# EasyEDA Pro project 微型麦轮车底盘V7_2024-09-14.epro

# Schematic ESP32微型麦轮车底盘V3_驭风
Board Name: ESP32微型麦轮车底盘V3_驭风; Create Date: 2024-09-10; Page Name: Sheet_1; Schematic Name: ESP32微型麦轮车底盘V3_驭风; Update Date: 2024-09-13
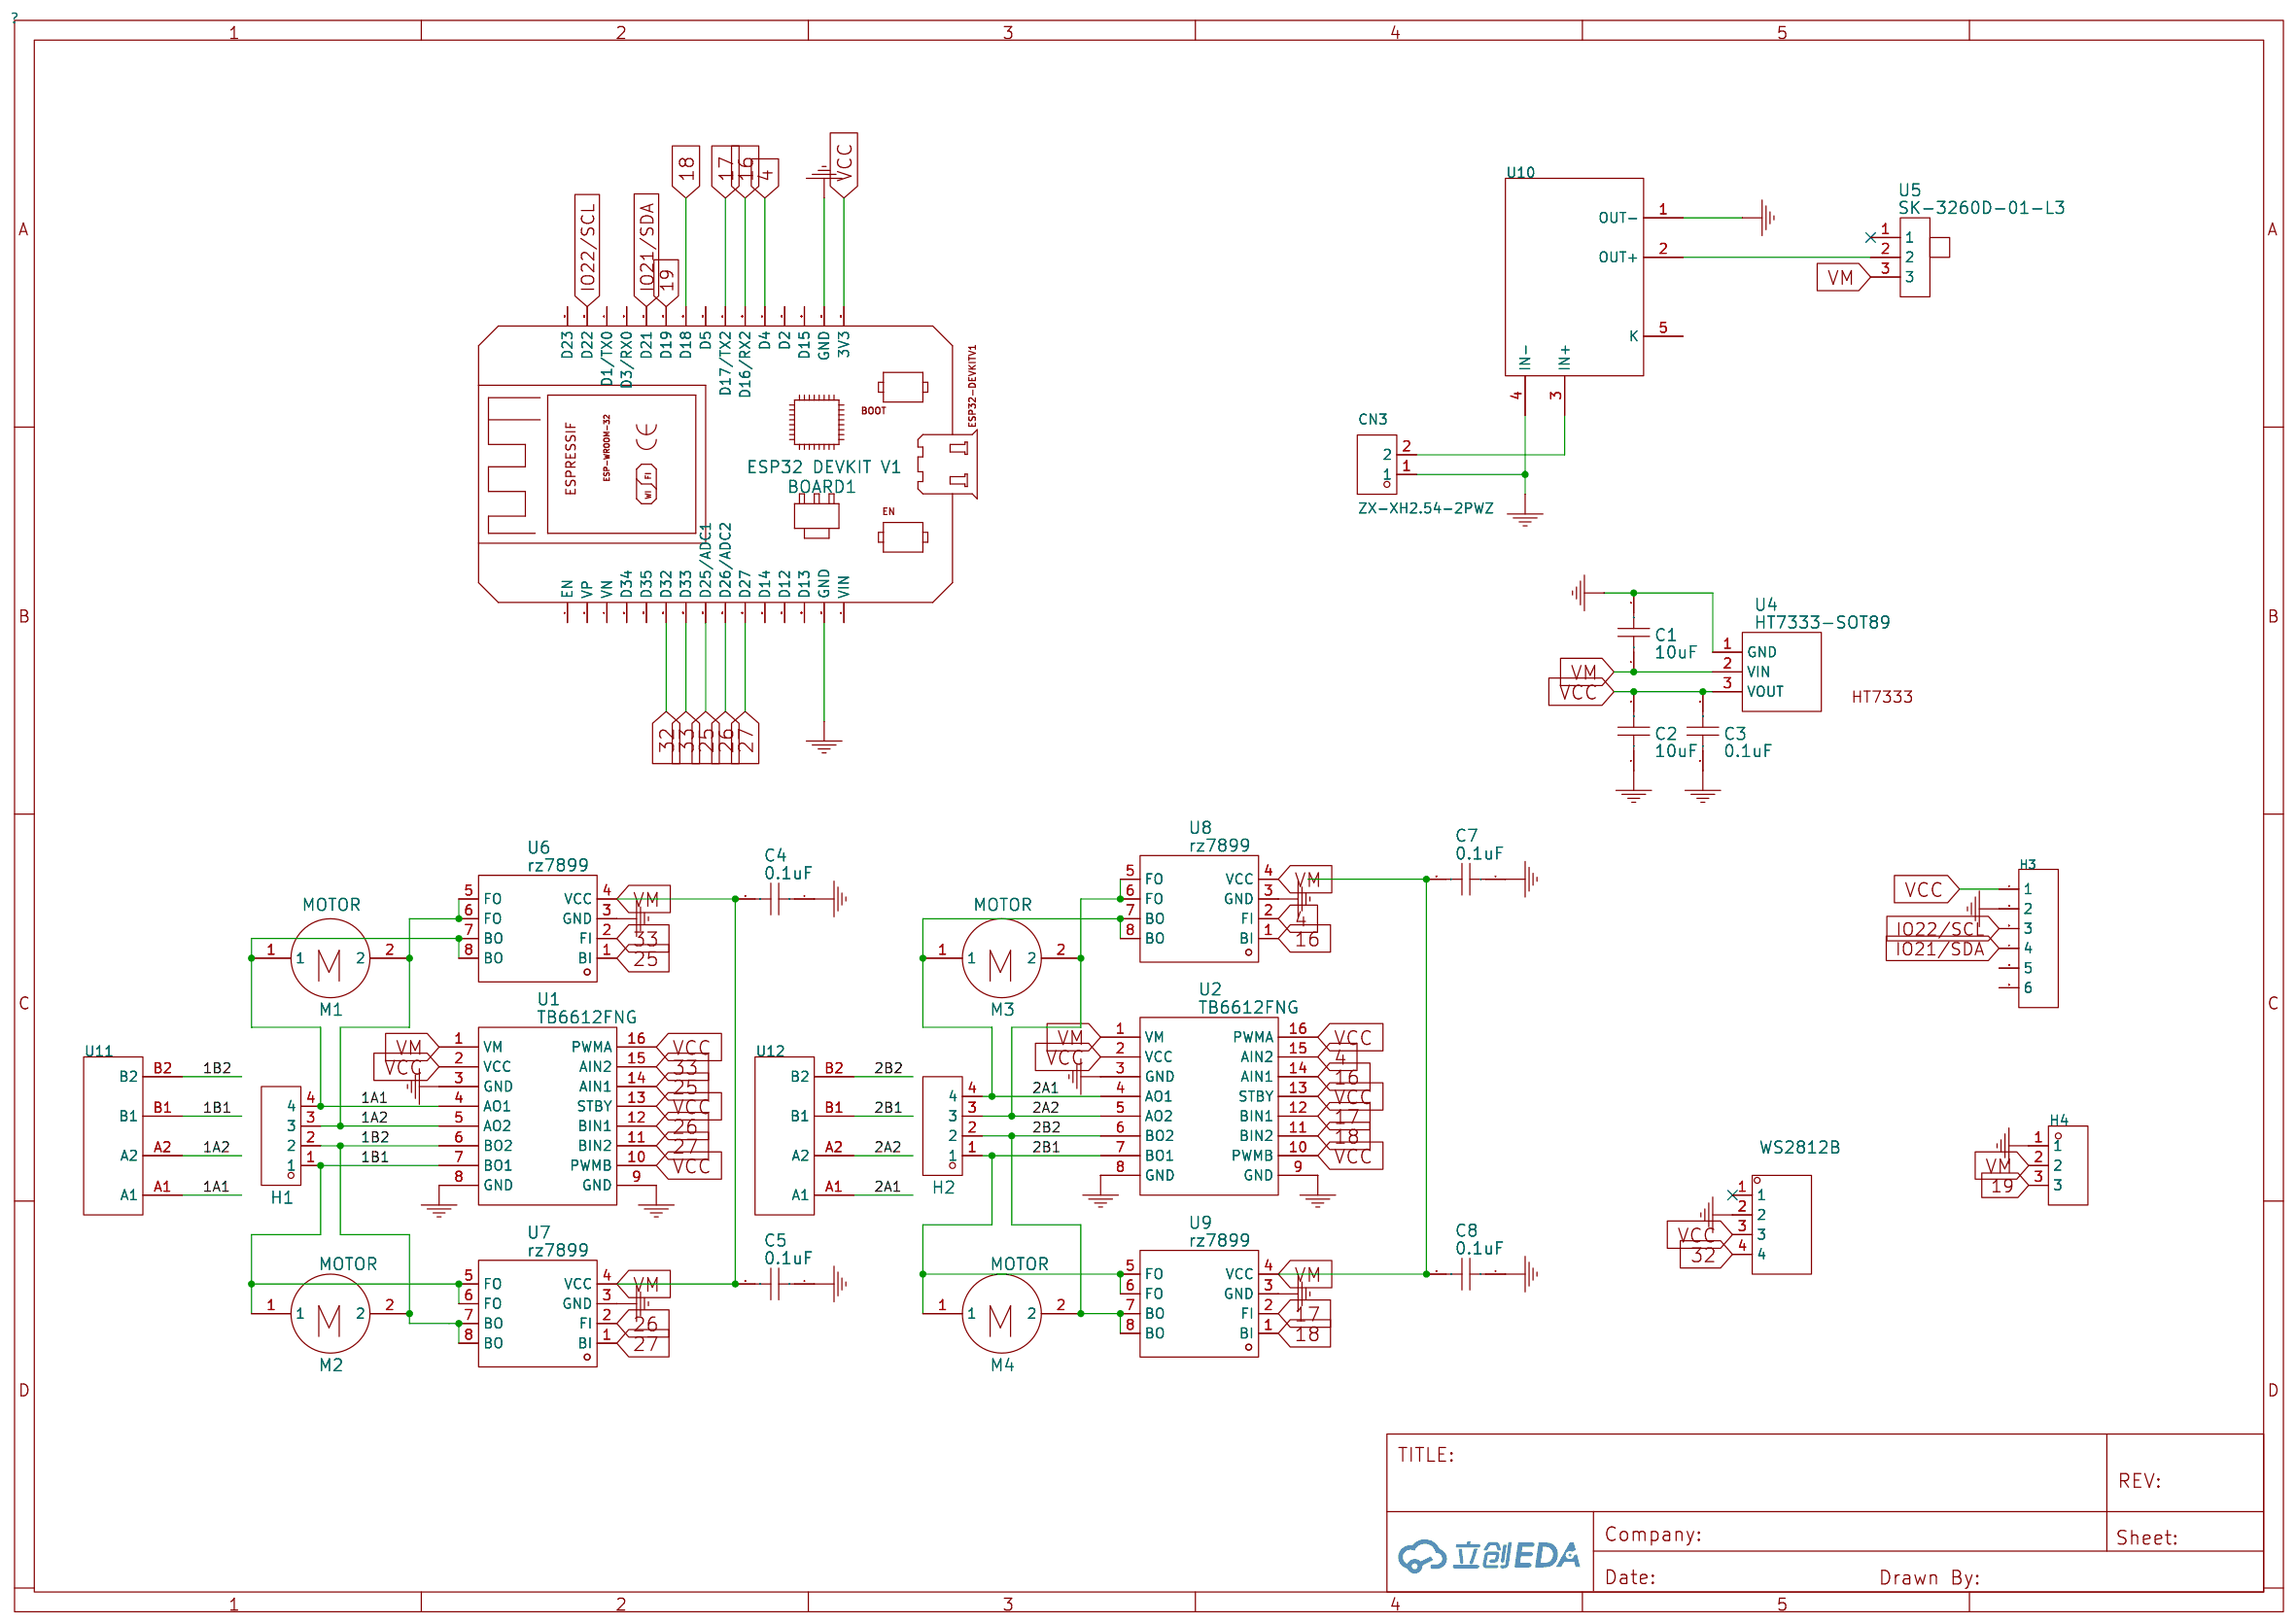
[diagram p0: schematic sheet]

## Parts
BOARD1  ESP32 DEVKIT V1  [ESP32-DEVKITV1]
C1  10uF  [C0805]
C2  10uF  [C0805]
C3  0.1uF  [C0805]
C4  0.1uF  [C0805]
C5  0.1uF  [C0805]
C7  0.1uF  [C0805]
C8  0.1uF  [C0805]
CN3  ZX-XH2.54-2PWZ  [CONN-TH_2P-P2.50_ZX-XH2.54-2PWZ]
H1  GP25-2521WV-4P  [HDR-TH_4P-P2.54-V-F]
H2  GP25-2521WV-4P  [HDR-TH_4P-P2.54-V-F]
H3  -  [HDR-TH_6P-P2.54-V-M-1]
H4  -  [HDR-TH_3P-P2.54-V-M]
M1  MOTOR  [MOTOR]
M2  MOTOR  [MOTOR]
M3  MOTOR  [MOTOR]
M4  MOTOR  [MOTOR]
U1  TB6612FNG  [TB6612FNG]
U2  TB6612FNG  [TB6612FNG]
U4  HT7333-SOT89  [HT7333_SOT-89]
U5  SK-3260D-01-L3  [SW-TH_SK-3260D-01-LX]
U6  rz7899  [SOP-8_L4.9-W3.9-P1.27-LS6.0-BL]
U7  rz7899  [SOP-8_L4.9-W3.9-P1.27-LS6.0-BL]
U8  rz7899  [SOP-8_L4.9-W3.9-P1.27-LS6.0-BL]
U9  rz7899  [SOP-8_L4.9-W3.9-P1.27-LS6.0-BL]
U10  -  [5V模块]
U11  -  [M]
U12  -  [M]
WS2812B  MTP125-1104S1  [HDR-TH_4P-P2.54-V]

## Library data of the parts
BOARD1 = ESP32 DEVKIT V1
C1-C5 C7 C8 = 0603F225M250NT: Supplier: LCSC; Supplier Part: C71001; Manufacturer: Guangdong Fenghua Advanced Tech
CN3 = ZX-XH2.54-2PWZ: 插针结构:1x2P;间距:2.54mm;安装方式:弯插;参考系列:XH;总PIN数:2P;排数:1;每排PIN数:2;行距:-;额定电流:3A;触头材质:黄铜;触头镀层:锡;工作温度范围:-25℃~+85℃;; Supplier Part: C7429641; Manufacturer: Megastar(兆星); Supplier Footprint: 弯插,P=2.54mm; JLCPCB Part Class: 扩展库; Datasheet: https://atta.szlcsc.com/upload/public/pdf/source/20230619/56AE8F2E01CDFEAA97FC89B5ED558AB5.pdf; Supplier: LCSC; Pins Structure: 1x2P; Pitch: 2.54mm; Mounting Style: 弯插; Reference Series: XH; Number of Pins: 2P; Number of Rows: 1; Number of PINs Per Row: 2; Current Rating (Max): 3A; Contact Material: 黄铜; Contact Plating: 锡; Operating Temperature Range: -25℃~+85℃
H1 H2 = GP25-2521WV-4P: Supplier: LCSC; Supplier Part: C2681745; Manufacturer: GEPU(歌普); JLCPCB Part Class: Extended Part
H3 = HDR-M_2.54_1x6P: Supplier Part: C37208; Supplier Footprint: 插件
H4 = HDR-M_2.54_1x3P: Supplier Part: C2937625; Supplier Footprint: 插件
M1-M4 = MOTOR
U1 U2 = TB6612FNG
U4 = HT7333-SOT89
U5 = SK-3260D-01-L3: Manufacturer: XKB Connectivity; Supplier Part: C692482; Supplier: Seeed
U6-U9 = rz7899: Supplier: LCSC; Manufacturer: RZ; Supplier Part: C92373; JLCPCB Part Class: Extended Part
U10 = 5V模块
U11 U12 = M
WS2812B = MTP125-1104S1: Supplier: LCSC; Supplier Part: C358686; Manufacturer: MINTRON; JLCPCB Part Class: Extended Part

## Nets
GND: BOARD1.GND BOARD1.GND@1(GND) C1.2 C2.1 C3.1 C4.1 C5.1 C7.1 C8.1 CN3.1 H3.2 H4.1 U1.3(GND) U1.8(GND) U1.9(GND) U2.3(GND) U2.8(GND) U2.9(GND) U4.1(GND) U6.3(GND) U7.3(GND) U8.3(GND) U9.3(GND) U10.1(OUT-) U10.4(IN-) WS2812B.2
VCC: BOARD1.3V3 C2.2 C3.2 H3.1 U1.2(VCC) U1.10(PWMB) U1.13(STBY) U1.16(PWMA) U2.2(VCC) U2.10(PWMB) U2.13(STBY) U2.16(PWMA) U4.3(VOUT) WS2812B.3
1A1: H1.4 M1.1 U1.4(AO1) U6.7(BO) U6.8(BO) U11.A1
1A2: H1.3 M1.2 U1.5(AO2) U6.5(FO) U6.6(FO) U11.A2
1B1: H1.1 M2.1 U1.7(BO1) U7.5(FO) U7.6(FO) U11.B1
1B2: H1.2 M2.2 U1.6(BO2) U7.7(BO) U7.8(BO) U11.B2
2A1: H2.4 M3.1 U2.4(AO1) U8.7(BO) U8.8(BO) U12.A1
2A2: H2.3 M3.2 U2.5(AO2) U8.5(FO) U8.6(FO) U12.A2
2B1: H2.1 M4.1 U2.7(BO1) U9.5(FO) U9.6(FO) U12.B1
2B2: H2.2 M4.2 U2.6(BO2) U9.7(BO) U9.8(BO) U12.B2
4: BOARD1.D4 U2.15(AIN2) U8.2(FI)
16: BOARD1.D16(D16/RX2) U2.14(AIN1) U8.1(BI)
17: BOARD1.D17(D17/TX2) U2.12(BIN1) U9.2(FI)
18: BOARD1.D18 U2.11(BIN2) U9.1(BI)
19: BOARD1.D19 H4.3
25: BOARD1.D25(D25/ADC1) U1.14(AIN1) U6.1(BI)
26: BOARD1.D26(D26/ADC2) U1.12(BIN1) U7.2(FI)
27: BOARD1.D27 U1.11(BIN2) U7.1(BI)
32: BOARD1.D32 WS2812B.4
33: BOARD1.D33 U1.15(AIN2) U6.2(FI)
IO21/SDA: BOARD1.D21 H3.4
IO22/SCL: BOARD1.D22 H3.3
VM: C1.1 C4.2 C5.2 C7.2 C8.2 H4.2 U1.1(VM) U2.1(VM) U4.2(VIN) U5.3 U6.4(VCC) U7.4(VCC) U8.4(VCC) U9.4(VCC)
$1N278: U5.2 U10.2(OUT+)
$1N1630: CN3.2 U10.3(IN+)

Not connected (* = marked no-connect by the designer): BOARD1 D1(D1/TX0) D2 D3(D3/RX0) D5 D12 D13 D14 D15 D23 D34 D35 EN VIN VN VP; H3 5 6; U5 1*; U10 5(K); WS2812B 1*

# Board ESP32_Mecanum_Car_PCB_V3
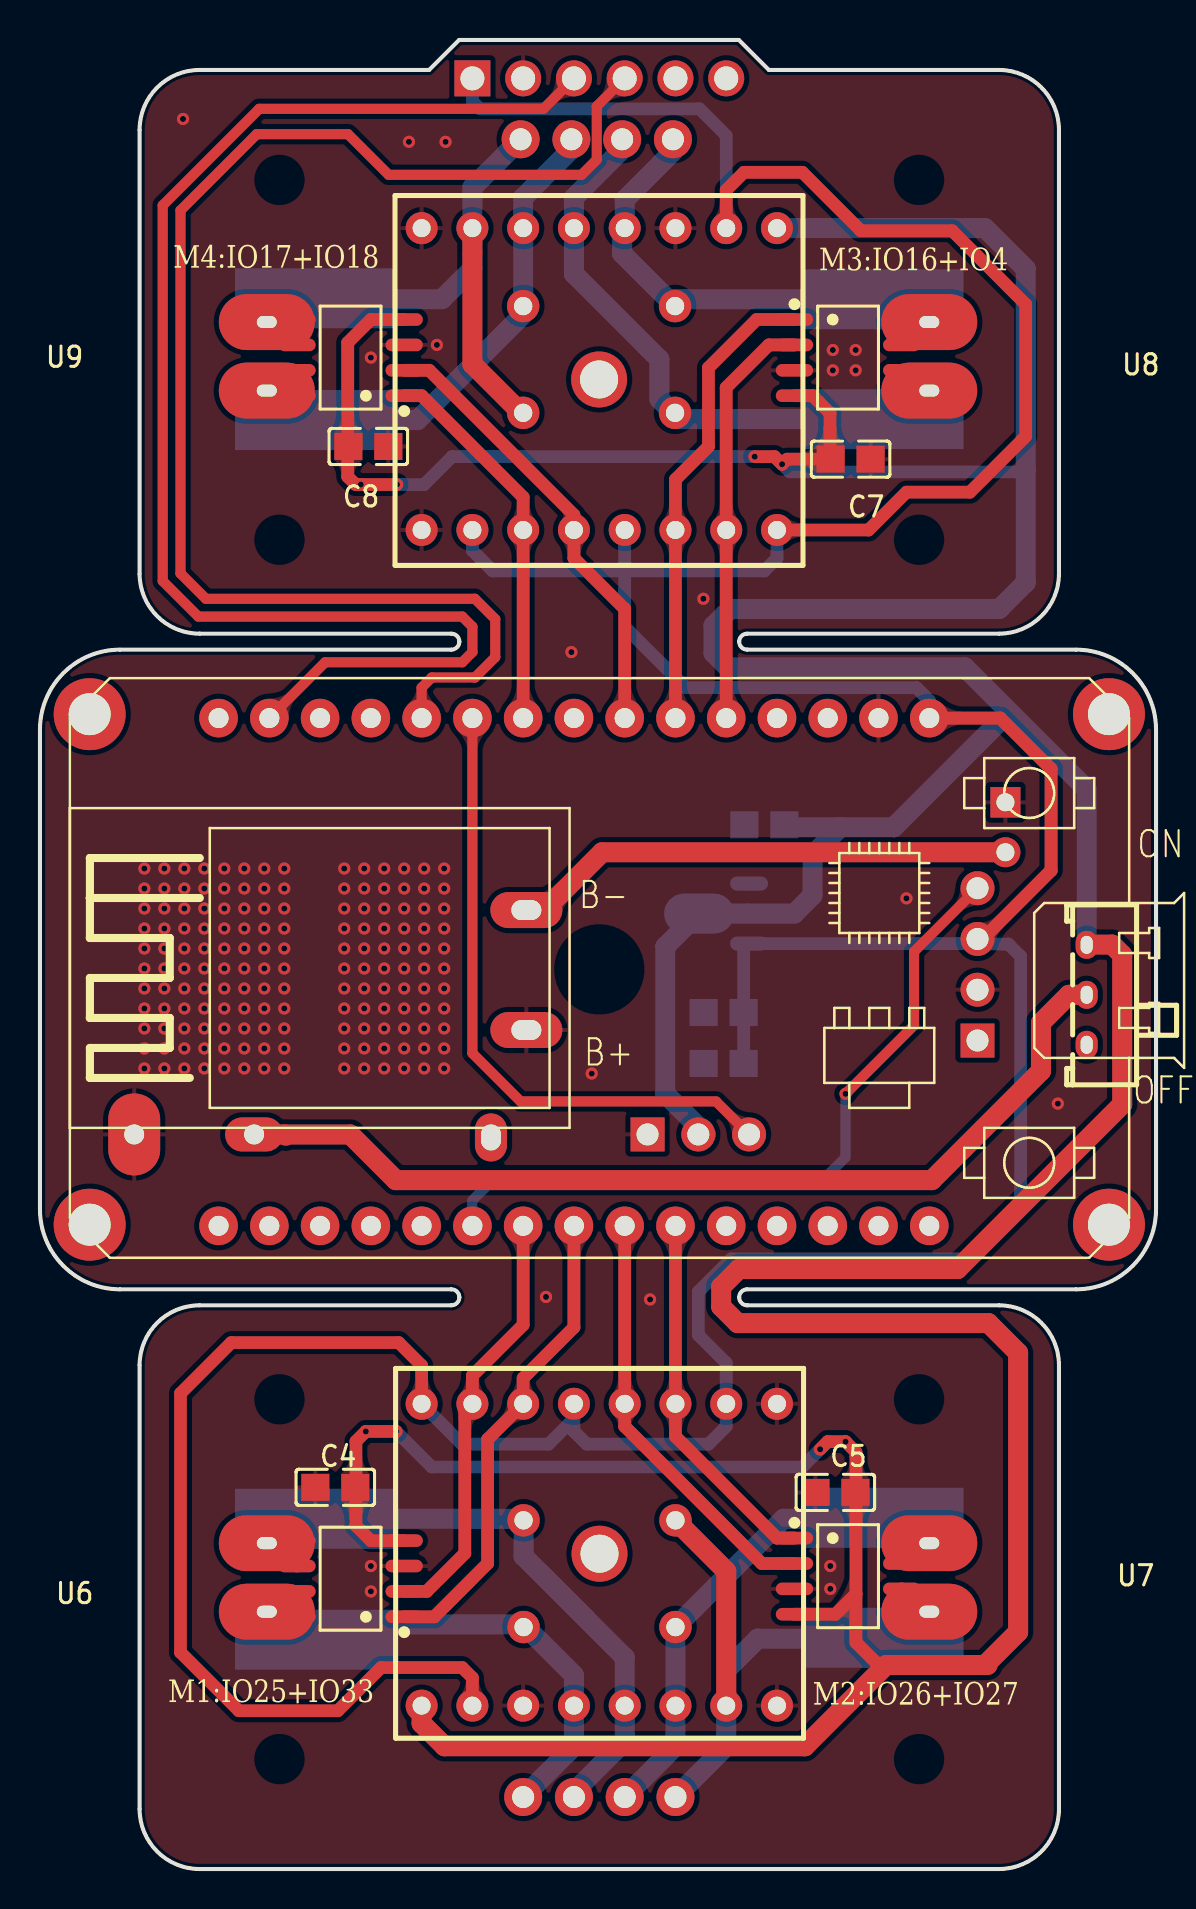
[diagram p1: board, top side]
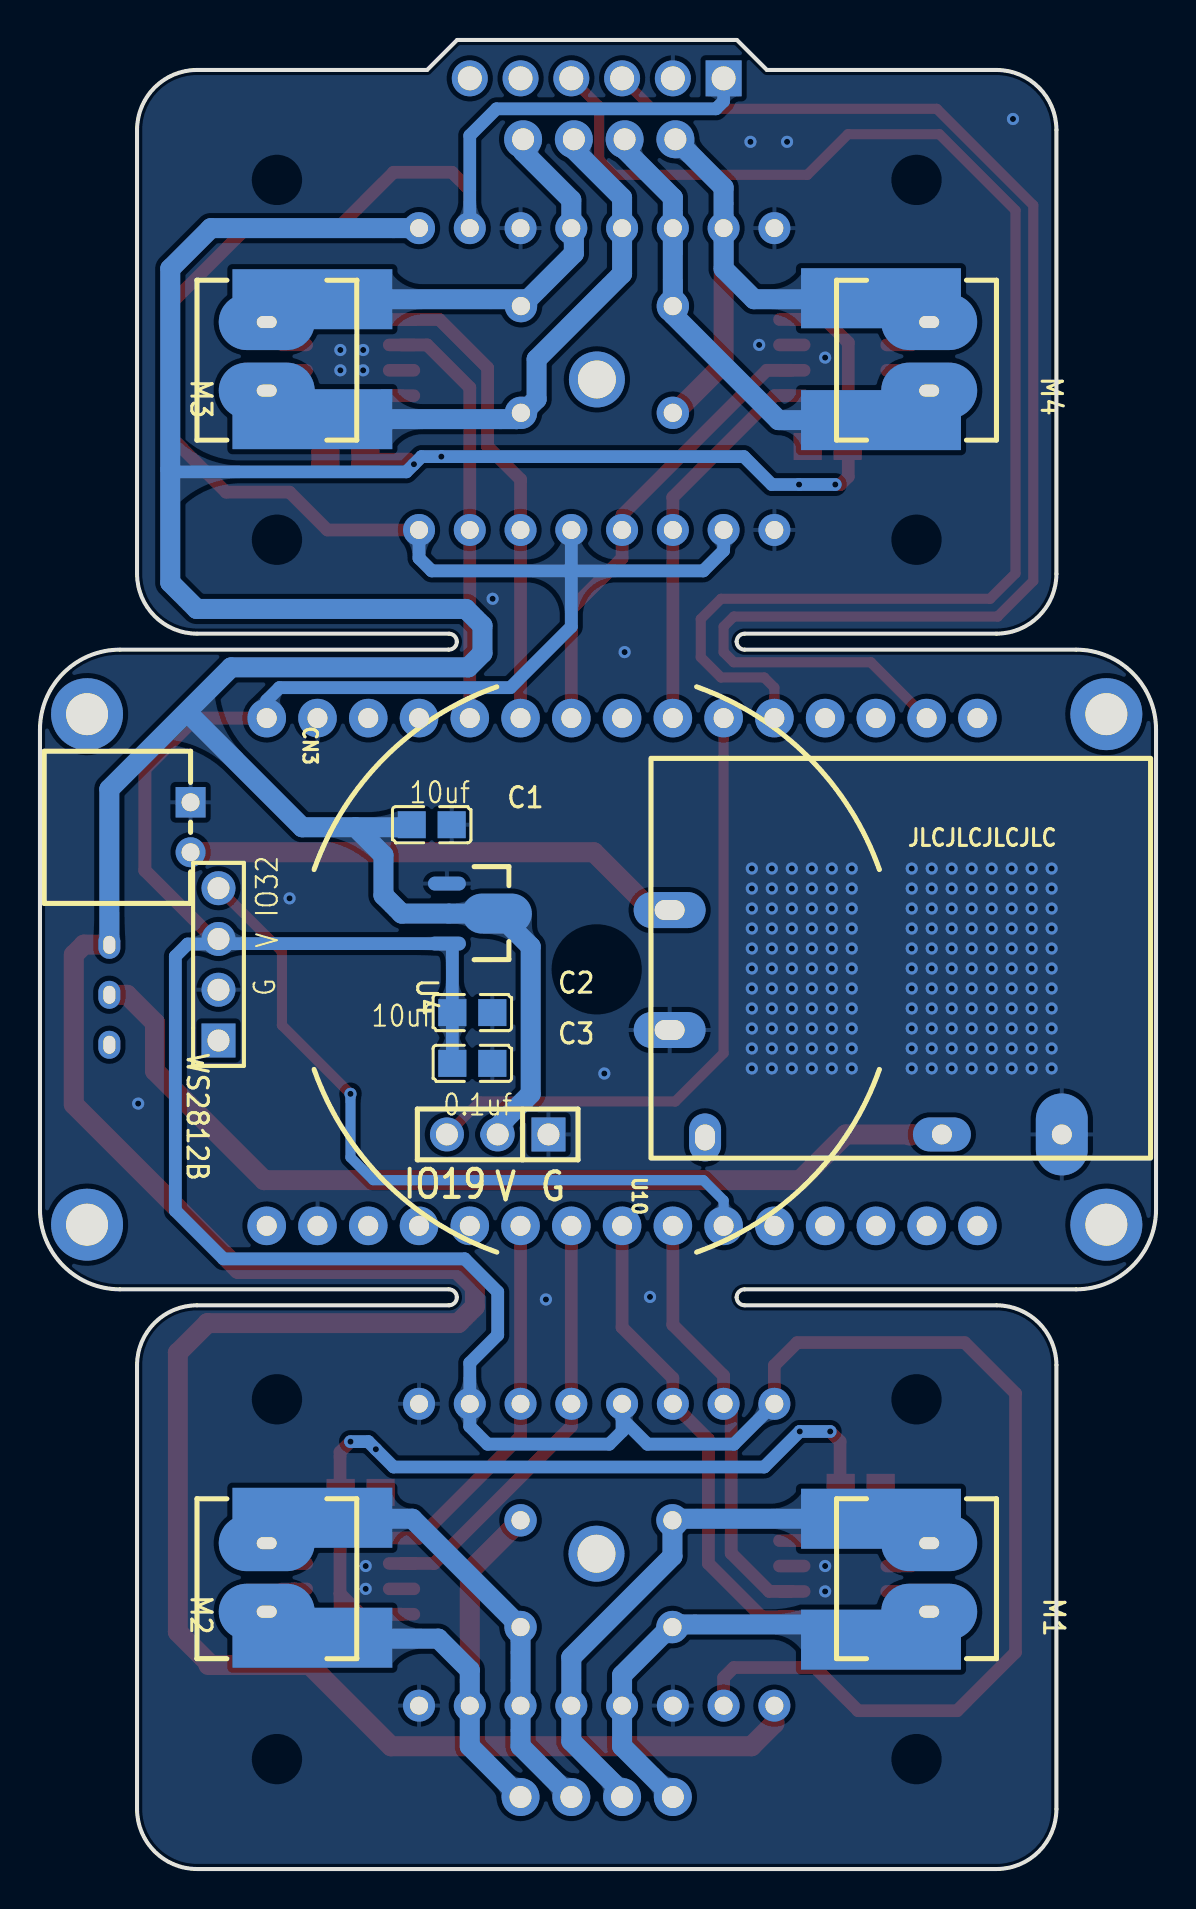
[diagram p2: board, bottom side, seen from below]

Outline 55.84 x 91.5 mm; copper layers: Top Layer, Bottom Layer. Coordinates in mm from the lower left corner of the outline.
Outline path: 0,57 0,33 arc(1.17,30.17) 4,29 20.58,29 arc(20.87,28.88) 20.98,28.6 arc(20.87,28.32) 20.58,28.2 7.98,28.2 arc(5.86,27.32) 4.98,25.2 4.98,3 arc(5.86,0.88) 7.98,0 47.98,0 arc(50.11,0.88) 50.98,3 50.98,25.2 arc(50.11,27.32) 47.98,28.2 35.38,28.2 arc(35.1,28.32) 34.98,28.6 arc(35.1,28.88) 35.38,29 51.84,29 arc(54.67,30.17) 55.84,33 55.84,57 arc(54.67,59.83) 51.84,61 35.38,61 arc(35.1,61.12) 34.98,61.4 arc(35.1,61.68) 35.38,61.8 47.98,61.8 arc(50.11,62.68) 50.98,64.8 50.98,87 arc(50.11,89.12) 47.98,90 36.47,90 34.97,91.5 20.97,91.5 19.47,90 7.98,90 arc(5.86,89.12) 4.98,87 4.98,64.8 arc(5.86,62.68) 7.98,61.8 20.58,61.8 arc(20.87,61.68) 20.98,61.4 arc(20.87,61.12) 20.58,61 4,61 arc(1.17,59.83) 0,57
Stack: Top Layer 0.035mm / Dielectric1 1.51mm FR4 er 4.5 / Bottom Layer 0.035mm

## Design rules (mm)
spacing Default (default): track to track 0.152, other pairs 0 to 0.152
track width Default (default): min 0.254, default 0.254, max 25.4
differential pair differentialPair (default): width min 0.127, default 0.254, max 2.54; gap min 0.152, default 0.152
via Default (default): diameter min 0.61, default 0.61, max 100.025; hole min 0.305, default 0.305, max 59.995
net GND uses gge16739

## Placement (name value [footprint] x y rotation side)
BOARD1  ESP32 DEVKIT V1  [ESP32-DEVKITV1]  44.5 57.58 180 top
C1  10uF  [C0805]  36.24 52.24 180 bottom
C2  10uF  [C0805]  34.21 42.84 0 bottom
C3  0.1uF  [C0805]  34.21 40.3 0 bottom
C4  0.1uF  [C0805]  14.78 19.09 0 top
C5  0.1uF  [C0805]  39.8 18.84 0 top
C7  0.1uF  [C0805]  40.56 70.53 180 top
C8  0.1uF  [C0805]  16.43 71.16 180 top
CN3  ZX-XH2.54-2PWZ  [CONN-TH_2P-P2.50_ZX-XH2.54-2PWZ]  48.31 52.11 270 bottom
H1  GP25-2521WV-4P  [HDR-TH_4P-P2.54-V-F]  27.99 3.6 180 top
H2  GP25-2521WV-4P  [HDR-TH_4P-P2.54-V-F]  27.86 86.53 0 top
H3  -  [HDR-TH_6P-P2.54-V-M-1]  27.99 89.58 0 top
H4  -  [HDR-TH_3P-P2.54-V-M]  32.94 36.75 0 bottom
M1  -  [MOTOR]  11.98 14.52 90 bottom
M2  -  [MOTOR]  43.99 14.52 90 bottom
M3  -  [MOTOR]  43.99 75.48 270 bottom
M4  -  [MOTOR]  11.98 75.48 270 bottom
NOREF  -  [Pad_e1394]  53.49 57.77 0 top
NOREF#2  -  [Pad_e944]  11.35 73.96 270 top
NOREF#3  -  [Pad_e943]  11.35 77.39 270 top
NOREF#4  -  [Pad_e97]  13.76 72.48 0 top
NOREF#5  -  [Pad_e941]  44.5 12.87 270 top
NOREF#6  -  [Pad_e98]  42.21 72.53 0 top
NOREF#7  -  [Pad_e1396]  53.49 32.23 0 top
NOREF#8  -  [Pad_e939]  11.35 16.3 270 top
NOREF#9  -  [Pad_e103]  42.21 17.57 0 top
NOREF#10  -  [Pad_e99]  42.21 78.53 0 top
NOREF#11  -  [Pad_e945]  44.5 77.39 270 top
NOREF#12  -  [Pad_e100]  13.76 17.52 0 top
NOREF#13  -  [Pad_e1395]  2.49 32.23 0 top
NOREF#14  -  [Pad_e940]  11.35 12.87 270 top
NOREF#15  -  [Pad_e101]  13.76 11.47 0 top
NOREF#16  -  [Pad_e1393]  2.49 57.77 0 top
NOREF#17  -  [Pad_e942]  44.5 16.3 270 top
NOREF#18  -  [Pad_e102]  42.21 11.57 0 top
NOREF#19  -  [Pad_e946]  44.5 73.96 270 top
NOREF#20  -  [Pad_e96]  13.76 78.58 0 top
U1  -  [TB6612FNG]  19.1 8.17 90 top
U2  -  [TB6612FNG]  36.88 82.09 270 top
U4  HT7333-SOT89  [HT7333_SOT-89]  32.94 47.67 270 bottom
U5  SK-3260D-01-L3  [SW-TH_SK-3260D-01-LX]  52.37 43.73 90 top
U6  rz7899  [SOP-8_L4.9-W3.9-P1.27-LS6.0-BL]  15.54 14.52 90 top
U7  rz7899  [SOP-8_L4.9-W3.9-P1.27-LS6.0-BL]  40.43 14.65 270 top
U8  rz7899  [SOP-8_L4.9-W3.9-P1.27-LS6.0-BL]  40.43 75.61 270 top
U9  rz7899  [SOP-8_L4.9-W3.9-P1.27-LS6.0-BL]  15.54 75.61 90 top
U10  -  [5V模块]  10.71 36.75 90 bottom
U11  -  [M]  31.8 17.44 180 top
U12  -  [M]  24.18 72.85 0 top
WS2812B  MTP125-1104S1  [HDR-TH_4P-P2.54-V]  46.91 45.26 90 bottom

## Footprints (pads in the part's own frame, mm; a bottom-side part is the same pattern mirrored in y, then rotated)
5V模块
  oval 4.1x2.6 hole 1: 1(0,-6)
  oval 1.7x2.9 hole 1: 2(0,0)
  oval 1.8x3.6 hole 1x1.5: 3(11.225,13.622) 4(5.225,13.622)
  oval 2.4x1.6 hole 1.3x1: 5(-0.15,11.85)
C0805
  rect 1.41x1.35 smd: 1(-1,0) 2(1,0)
CONN-TH_2P-P2.50_ZX-XH2.54-2PWZ
  rect 1.524x1.5 hole 0.9: 1(-1.25,0)
  round 1.5 hole 0.9: 2(1.25,0)
ESP32-DEVKITV1
  round 1.931 hole 1x1: 3V3(0,0) D1(30.48,0) D2(7.62,0) D3(27.94,0) D4(10.16,0) D5(17.78,0) D12(7.62,25.4) D13(5.08,25.4) D14(10.16,25.4) D15(5.08,0) D16(12.7,0) D17(15.24,0) D18(20.32,0) D19(22.86,0) D21(25.4,0) D22(33.02,0) D23(35.56,0) D25(17.78,25.4) D26(15.24,25.4) D27(12.7,25.4) D32(22.86,25.4) D33(20.32,25.4) D34(27.94,25.4) D35(25.4,25.4) EN(35.56,25.4) GND(2.54,25.4) GND@1(2.54,0) VIN(0,25.4) VN(30.48,25.4) VP(33.02,25.4)
HDR-TH_3P-P2.54-V-M
  rect 1.7x1.7 hole 1.1: 1(-2.54,0)
  round 1.7 hole 1.1: 2(0,0) 3(2.54,0)
HDR-TH_4P-P2.54-V
  rect 1.7x1.7 hole 1.1: 1(-3.81,0)
  round 1.7 hole 1.1: 2(-1.27,0) 3(1.27,0) 4(3.81,0)
HDR-TH_4P-P2.54-V-F
  round 1.9 hole 1.1x1: 1(-3.81,0) 2(-1.27,0) 3(1.27,0) 4(3.81,0)
HDR-TH_6P-P2.54-V-M-1
  rect 1.8x1.8 hole 1.2: 1(-6.35,0)
  round 1.8 hole 1.2: 2(-3.81,0) 3(-1.27,0) 4(1.27,0) 5(3.81,0) 6(6.35,0)
HT7333_SOT-89
  oval 0.7x1.9 smd: 1(-1.628,-2.54) 3(1.374,-2.54)
  oval 0.7x2.1 smd: 2(-0.127,-2.441)
  oval 2x3.5 smd: 2(-0.127,-0.041)
M
  round 2.8 hole 1.9: 0(3.8,1.67)
  round 1.62 hole 0.914: A1(7.6,5.34) A2(7.6,0) B1(0,0) B2(0,5.34)
MOTOR
  rect 2x4 smd: 1(-3,0) 2(3,0)
Pad_e96
  rect 8x3 smd far side: 2(0,0)
Pad_e97
  rect 8x3 smd far side: 1(0,0)
Pad_e98
  rect 8x3 smd far side: 1(0,0)
Pad_e99
  rect 8x3 smd far side: 1(0,0)
Pad_e100
  rect 8x3 smd far side: 1(0,0)
Pad_e101
  rect 8x3 smd far side: 1(0,0)
Pad_e102
  rect 8x3 smd far side: 1(0,0)
Pad_e103
  rect 8x3 smd far side: 1(0,0)
Pad_e939
  oval 2.8x4.8 hole 0.6x1: 3(0,0)
Pad_e940
  oval 2.8x4.8 hole 0.6x1: 3(0,0)
Pad_e941
  oval 2.8x4.8 hole 0.6x1: 3(0,0)
Pad_e942
  oval 2.8x4.8 hole 0.6x1: 3(0,0)
Pad_e943
  oval 2.8x4.8 hole 0.6x1: 3(0,0)
Pad_e944
  oval 2.8x4.8 hole 0.6x1: 3(0,0)
Pad_e945
  oval 2.8x4.8 hole 0.6x1: 3(0,0)
Pad_e946
  oval 2.8x4.8 hole 0.6x1: 3(0,0)
Pad_e1393
  round 3.6 hole 2.1: 1(0,0)
Pad_e1394
  round 3.6 hole 2.1: 2(0,0)
Pad_e1395
  round 3.6 hole 2.1: 3(0,0)
Pad_e1396
  round 3.6 hole 2.1: 4(0,0)
SOP-8_L4.9-W3.9-P1.27-LS6.0-BL
  oval 0.63x1.865 smd: 1(-1.905,-2.683) 2(-0.635,-2.683) 3(0.635,-2.683) 4(1.905,-2.683) 5(1.905,2.683) 6(0.635,2.683) 7(-0.635,2.683) 8(-1.905,2.683)
SW-TH_SK-3260D-01-LX
  oval 1.4x1.1 hole 0.9x0.6: 1(-2.5,0) 2(0,0) 3(2.5,0)
TB6612FNG
  round 1.6 hole 0.9: 1(0,0) 2(0,-2.54) 3(0,-5.08) 4(0,-7.62) 5(0,-10.16) 6(0,-12.7) 7(0,-15.24) 8(0,-17.78) 9(15.1,-17.78) 10(15.1,-15.24) 11(15.1,-12.7) 12(15.1,-10.16) 13(15.1,-7.62) 14(15.1,-5.08) 15(15.1,-2.54) 16(15.1,0)

## Nets
GND: BOARD1.GND BOARD1.GND@1 C1.2 C2.1 C3.1 C4.1 C5.1 C7.1 C8.1 CN3.1 H3.2 H4.1 U1.3 U1.8 U1.9 U2.3 U2.8 U2.9 U4.1 U6.3 U7.3 U8.3 U9.3 U10.1 U10.4 WS2812B.2
VCC: BOARD1.3V3 C2.2 C3.2 H3.1 U1.2 U1.10 U1.13 U1.16 U2.2 U2.10 U2.13 U2.16 U4.3 WS2812B.3
1A1: H1.4 M1.1 NOREF#14.3 NOREF#15.1 U1.4 U6.7 U6.8 U11.A1
1A2: H1.3 M1.2 NOREF#8.3 NOREF#12.1 U1.5 U6.5 U6.6 U11.A2
1B1: H1.1 M2.1 NOREF#5.3 NOREF#18.1 U1.7 U7.5 U7.6 U11.B1
1B2: H1.2 M2.2 NOREF#9.1 NOREF#17.3 U1.6 U7.7 U7.8 U11.B2
2A1: H2.4 M3.1 NOREF#10.1 NOREF#11.3 U2.4 U8.7 U8.8 U12.A1
2A2: H2.3 M3.2 NOREF#6.1 NOREF#19.3 U2.5 U8.5 U8.6 U12.A2
2B1: H2.1 M4.1 NOREF#3.3 NOREF#20.2 U2.7 U9.5 U9.6 U12.B1
2B2: H2.2 M4.2 NOREF#2.3 NOREF#4.1 U2.6 U9.7 U9.8 U12.B2
4: BOARD1.D4 U2.15 U8.2
16: BOARD1.D16 U2.14 U8.1
17: BOARD1.D17 U2.12 U9.2
18: BOARD1.D18 U2.11 U9.1
19: BOARD1.D19 H4.3
25: BOARD1.D25 U1.14 U6.1
26: BOARD1.D26 U1.12 U7.2
27: BOARD1.D27 U1.11 U7.1
32: BOARD1.D32 WS2812B.4
33: BOARD1.D33 U1.15 U6.2
IO21/SDA: BOARD1.D21 H3.4
IO22/SCL: BOARD1.D22 H3.3
VM: C1.1 C4.2 C5.2 C7.2 C8.2 H4.2 U1.1 U2.1 U4.2 U5.3 U6.4 U7.4 U8.4 U9.4
$1N278: U5.2 U10.2
$1N1630: CN3.2 U10.3

Pads without a net: BOARD1 D1 D2 D3 D5 D12 D13 D14 D15 D23 D34 D35 EN VIN VN VP; H3 5 6; NOREF 2; NOREF#7 4; NOREF#13 3; NOREF#16 1; U5 1; U10 5; U11 0; U12 0; WS2812B 1

## Via types
v1: diameter 0.61, hole 0.305, Top Layer to Bottom Layer, 183 vias

## Routing (per net, layer and track width the routed paths; a pad name or vN(x,y) marks a point on that pad's centre or on a via; arc(x,y) is an arc through that point)
GND:
  vias: v1(5.22,50.05) v1(5.22,49.05) v1(5.22,48.05) v1(5.22,47.05) v1(5.22,46.05) v1(5.22,45.05) v1(5.22,44.05) v1(5.22,43.05) v1(5.22,42.05) v1(5.22,41.05) v1(5.22,40.05) v1(6.22,50.05) v1(6.22,49.05) v1(6.22,48.05) v1(6.22,47.05) v1(6.22,46.05) v1(6.22,45.05) v1(6.22,44.05) v1(6.22,43.05) v1(6.22,42.05) v1(6.22,41.05) v1(6.22,40.05) v1(7.16,87.55) v1(7.22,50.05) v1(7.22,49.05) v1(7.22,48.05) v1(7.22,47.05) v1(7.22,46.05) v1(7.22,45.05) v1(7.22,44.05) v1(7.22,43.05) v1(7.22,42.05) v1(7.22,41.05) v1(7.22,40.05) v1(8.22,50.05) v1(8.22,49.05) v1(8.22,48.05) v1(8.22,47.05) v1(8.22,46.05) v1(8.22,45.05) v1(8.22,44.05) v1(8.22,43.05) v1(8.22,42.05) v1(8.22,41.05) v1(8.22,40.05) v1(9.22,50.05) v1(9.22,49.05) v1(9.22,48.05) v1(9.22,47.05) v1(9.22,46.05) v1(9.22,45.05) v1(9.22,44.05) v1(9.22,43.05) v1(9.22,42.05) v1(9.22,41.05) v1(9.22,40.05) v1(10.22,50.05) v1(10.22,49.05) v1(10.22,48.05) v1(10.22,47.05) v1(10.22,46.05) v1(10.22,45.05) v1(10.22,44.05) v1(10.22,43.05) v1(10.22,42.05) v1(10.22,41.05) v1(10.22,40.05) v1(11.22,50.05) v1(11.22,49.05) v1(11.22,48.05) v1(11.22,47.05) v1(11.22,46.05) v1(11.22,45.05) v1(11.22,44.05) v1(11.22,43.05) v1(11.22,42.05) v1(11.22,41.05) v1(11.22,40.05) v1(12.22,50.05) v1(12.22,49.05) v1(12.22,48.05) v1(12.22,47.05) v1(12.22,46.05) v1(12.22,45.05) v1(12.22,44.05) v1(12.22,43.05) v1(12.22,42.05) v1(12.22,41.05) v1(12.22,40.05) v1(15.22,50.05) v1(15.22,49.05) v1(15.22,48.05) v1(15.22,47.05) v1(15.22,46.05) v1(15.22,45.05) v1(15.22,44.05) v1(15.22,43.05) v1(15.22,42.05) v1(15.22,41.05) v1(15.22,40.05) v1(16.22,50.05) v1(16.22,49.05) v1(16.22,48.05) v1(16.22,47.05) v1(16.22,46.05) v1(16.22,45.05) v1(16.22,44.05) v1(16.22,43.05) v1(16.22,42.05) v1(16.22,41.05) v1(16.22,40.05) v1(16.56,75.61) v1(16.56,15.16) v1(16.56,13.89) v1(17.22,50.05) v1(17.22,49.05) v1(17.22,48.05) v1(17.22,47.05) v1(17.22,46.05) v1(17.22,45.05) v1(17.22,44.05) v1(17.22,43.05) v1(17.22,42.05) v1(17.22,41.05) v1(17.22,40.05) v1(18.22,50.05) v1(18.22,49.05) v1(18.22,48.05) v1(18.22,47.05) v1(18.22,46.05) v1(18.22,45.05) v1(18.22,44.05) v1(18.22,43.05) v1(18.22,42.05) v1(18.22,41.05) v1(18.22,40.05) v1(18.46,86.4) v1(19.22,50.05) v1(19.22,49.05) v1(19.22,48.05) v1(19.22,47.05) v1(19.22,46.05) v1(19.22,45.05) v1(19.22,44.05) v1(19.22,43.05) v1(19.22,42.05) v1(19.22,41.05) v1(19.22,40.05) v1(19.86,76.24) v1(20.29,86.4) v1(20.22,50.05) v1(20.22,49.05) v1(20.22,48.05) v1(20.22,47.05) v1(20.22,46.05) v1(20.22,45.05) v1(20.22,44.05) v1(20.22,43.05) v1(20.22,42.05) v1(20.22,41.05) v1(20.22,40.05) v1(25.32,28.62) v1(26.59,60.88) v1(27.6,39.8) v1(30.53,28.49) v1(33.19,63.54) v1(39.54,15.16) v1(39.54,14.01) v1(39.67,75.99) v1(39.67,74.97) v1(40.81,75.99) v1(40.81,74.97) v1(43.35,48.56) v1(50.93,38.29)
VCC: length 241.6
  Top Layer w0.635: 19.1,23.27 19.1,25.19 17.95,26.33 9.57,26.33 7.03,23.79 7.03,10.84 9.95,7.92 14.91,7.92 17.06,10.08 21.13,10.08 21.64,9.57 U1.2 ; 36.88,66.99 41.46,66.99 43.35,68.88 46.53,68.88 49.32,71.67 49.32,78.28 45.64,81.96 41.07,81.96 38.15,84.88 35.22,84.88 34.34,83.99 34.34,82.09
  Top Layer w0.653: BOARD1.3V3 48.05,57.58 50.59,55.04 50.59,49.96 47.16,46.53 WS2812B.3
  Bottom Layer w0.635: 34.34,82.09 34.34,86.72 33,88.06 22.02,88.06 21.64,88.44 H3.1
  Bottom Layer w0.64: 29.1,64.94 29.26,64.94 ; 29.1,64.94 29.26,65.1 29.26,66.99 ; 29.1,64.94 22.65,64.94 21.64,65.96 21.64,66.99 ; 29.26,64.94 29.26,62.15 32.3,59.1 43.86,59.1 44.5,58.46 BOARD1.3V3 ; 29.26,64.94 36.24,64.94 36.88,65.58 36.88,66.99 ; 26.72,23.27 26.72,22.52 ; 26.72,22.52 26.72,21.89 27.36,21.25 33.45,21.25 34.34,22.14 34.34,25.32 32.94,26.71 32.94,28.87 34.59,30.52 46.66,30.52 49.07,32.94 49.07,45.66 48.45,46.27 47.16,46.27 46.93,46.51 46.72,46.3 U4.3 ; 26.72,22.52 25.45,21.25 21.12,21.25 19.1,23.27 ; C3.2 C2.2 35.21,46.26
1A1: length 22.7
  Top Layer w0.64: 12.86,13.89 12.86,12.62
  Bottom Layer w1: NOREF#15.1 14.52,12.24 24.18,12.24 26.72,9.7 U1.4 26.72,6.14 H1.4
1A2: length 28.8
  Top Layer w0.64: 12.86,15.16 12.86,16.43
  Bottom Layer w1: NOREF#12.1 24.2,17.52 U11.A2 24.2,15.65 29.26,10.59 U1.5 29.26,6.39 26.72,3.85 H1.3
1B1: length 29.3
  Top Layer w0.64: U7.6 U7.5
  Top Layer w1: 34.34,8.17 34.34,14.9 U11.B1
  Bottom Layer w1: 43.99,11.52 35.91,11.52 34.34,9.95 34.34,6.14 H1.1
1B2: length 25.3
  Top Layer w0.64: U7.8 43.11,15.28
  Bottom Layer w1: 43.99,17.52 37.21,17.52 31.8,12.11 U1.6 31.8,6.14 H1.2
2A1: length 20.8
  Bottom Layer w1: NOREF#10.1 31.41,78.53 29.13,80.82 29.13,81.96 U2.4 29.26,83.5 31.67,85.91 H2.4
2A2: length 27.4
  Bottom Layer w1: 42.21,72.53 31.99,72.53 30.99,73.53 30.99,75.52 26.72,79.8 U2.5 26.72,83.61 29.13,86.02 H2.3
2B1: length 28.2
  Top Layer w1: 24.18,72.75 21.64,75.29 U2.7
  Bottom Layer w1: H2.1 21.64,84.12 U2.7 21.64,80.05 20.11,78.53 11.98,78.53
2B2: length 24.1
  Bottom Layer w1: 11.98,72.48 18.89,72.48 24.18,77.77 24.18,83.61 26.59,86.02 H2.2
4: length 20.8
  Top Layer w0.64: 34.34,57.58 34.34,74.11 36.47,76.24 37.75,76.24
16: length 23.5
  Top Layer w0.64: 31.8,57.58 31.8,69.51 33.45,71.16 33.45,75.1 35.86,77.51 37.75,77.51
17: length 22.7
  Top Layer w0.64: U9.2 19.48,74.97 26.72,67.74 26.72,65.58 29.26,63.04 BOARD1.D17
18: length 19.1
  Top Layer w0.64: 24.18,57.58 24.18,68.62 19.1,73.7 U9.1
19: length 32.3
  Top Layer w0.508: H4.3 33.83,38.4 24.05,38.4 21.64,40.81 BOARD1.D19
25: length 24
  Top Layer w0.64: BOARD1.D25 26.72,27.1 24.18,24.56 24.18,23.27 22.4,21.5 22.4,15.28 19.73,12.62 U6.1
26: length 21.4
  Top Layer w0.64: 37.75,15.28 36.11,15.28 29.26,22.14 BOARD1.D26
27: length 18.6
  Top Layer w0.64: 37.75,16.55 36.88,16.55 31.8,21.63 31.8,32.18
32: length 37
  Top Layer w0.508: WS2812B.4 43.73,45.89 43.73,42.21 v1(40.31,38.78)
  Bottom Layer w0.508: BOARD1.D32 21.64,33.45 22.65,34.46 39.16,34.46 40.31,35.6 v1(40.31,38.78)
33: length 21.4
  Top Layer w0.64: U6.2 19.35,13.89 21.25,15.79 21.25,22.89 21.64,23.27 21.64,24.68 24.18,27.22 24.18,32.18
IO21/SDA: length 70.8
  Top Layer w0.508: BOARD1.D21 19.1,59.1 19.6,59.61 21.76,59.61 22.78,60.62 22.78,62.53 21.76,63.54 8.3,63.54 7.03,64.81 7.03,82.98 10.84,86.79 15.41,86.79 17.44,84.75 27.1,84.75 27.86,85.52 27.86,88.18 H3.4
IO22/SCL: length 71.2
  Top Layer w0.508: H3.3 25.19,88.06 10.97,88.06 6.14,83.23 6.14,64.43 7.92,62.66 21.13,62.66 21.64,62.15 21.64,60.88 21.13,60.37 14.27,60.37 BOARD1.D22
VM: length 316.2
  Top Layer w0.635: v1(35.76,70.66) 36.75,70.66 v1(37.13,70.28) 37.38,70.53 39.53,70.53 ; 40.83,18.84 40.83,20.86 v1(40.31,21.38) 39.42,21.38 v1(39.03,21) ; v1(17.83,21.89) v1(16.3,21.89) 15.81,21.4 15.81,17.18 16.56,16.43 U6.4 ; v1(17.86,69.26) v1(16.05,69.26) 15.79,69.26 15.4,69.65 15.4,71.16
  Top Layer w0.64: 15.4,71.16 15.4,76.36 16.56,77.51 U9.4 ; 37.75,73.7 38.65,73.7 39.53,72.83 39.53,70.53 ; 40.83,13.77 40.83,11.33 41.96,10.2 ; 40.83,13.77 40.83,18.84 ; 40.83,13.77 39.8,12.74 37.75,12.74
  Top Layer w1: 52.36,46.24 53.64,46.24 54.15,45.74 54.15,38.25 45.91,30.02 34.97,30.02 34.08,29.13 34.08,28.14 34.91,27.31 47.46,27.31 48.94,25.83 48.94,11.86 47.42,10.33 ; U1.1 19.1,7.28 20.24,6.14 38.27,6.14 42.34,10.2 47.42,10.2
  Bottom Layer w0.635: v1(40.31,21.38) 39.42,21.38 v1(39.03,21) 38.15,20.11 19.6,20.11 v1(17.83,21.89) v1(16.3,21.89) ; 49.32,70 49.22,69.89 37.51,69.89 v1(37.13,70.28) 36.75,70.66 v1(35.76,70.66) 20.62,70.66 19.22,69.26 v1(17.86,69.26) v1(16.05,69.26)
  Bottom Layer w1: U2.1 47.29,82.09 49.32,80.05 49.32,64.36 48,63.04 34.53,63.04 33.7,62.2 33.7,60.82 34.41,60.12 46.27,60.12 52.37,54.02 U5.3 ; C1.1 37.37,52.11 40.05,52.11 ; 40.05,52.11 38.65,50.72 38.65,48.71 37.74,47.8 U4.2 U4.2 32.94,47.8 31.29,46.15 31.29,38.78 33.32,36.75 ; 40.05,52.11 42.72,52.11 48.18,57.58
$1N278: length 47.8
  Top Layer w1: 12.3,36.68 12.24,36.75 U10.2 ; 12.37,36.75 15.52,36.75 17.81,34.46 44.62,34.46 50.08,39.92 50.08,42.34 51.48,43.73 U5.2
$1N1630: length 25.2
  Top Layer w1: U10.3 25.24,47.97 28.13,50.86 CN3.2

## Copper pours and planes (outline as drawn; the poured copper is in the pictures)
GND on Top Layer: -6.56,92.88 60.24,92.88 60.24,-5.42 -6.56,-5.42
GND on Bottom Layer: -1.73,93.26 58.09,93.26 58.09,-2.75 -1.73,-2.75

Small or netless copper shapes (teardrops, artwork), in the pictures only: 58 on Top Layer, 83 on Bottom Layer

## Text on the board
Bottom Silkscreen Layer: JLCJLCJLCJLC | V | G | IO32 | 0.1uf | 10uf | IO19
Top Silkscreen Layer: B- | B+ | OFF | ON | M1:IO25+IO33 | M4:IO17+IO18 | M2:IO26+IO27 | M3:IO16+IO4
